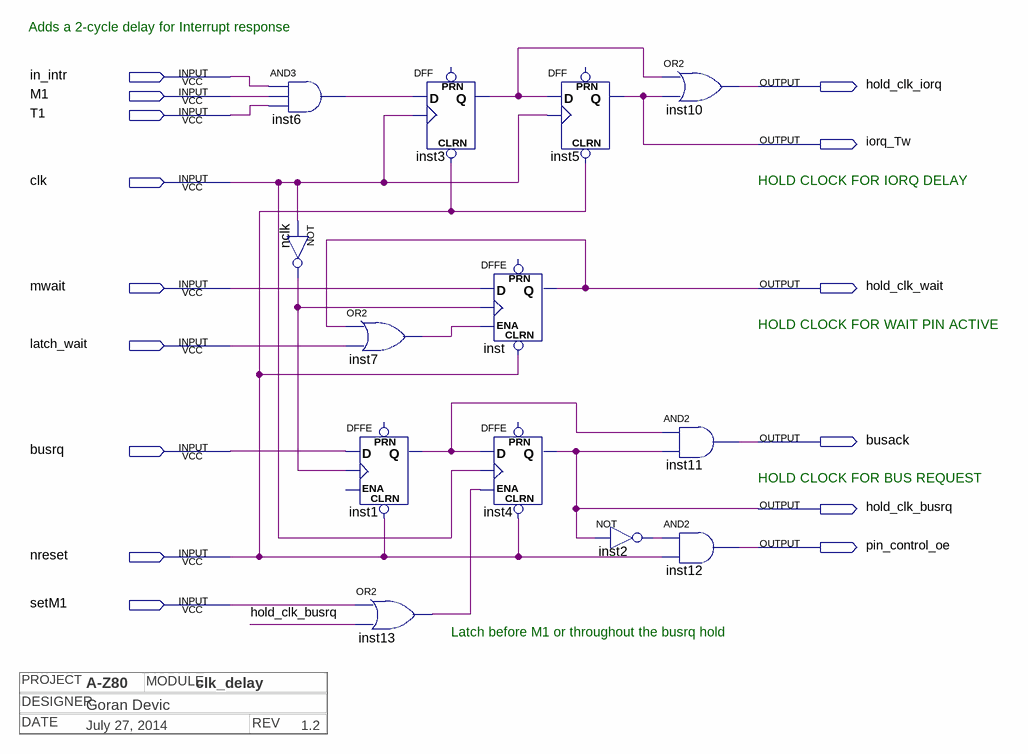
[diagram p0: schematic sheet]
// Quartus schematic clk_delay.bdf as structural Verilog: 13 symbols, 15 pins
// Title block: PROJECT: A-Z80; MODULE: clk_delay; DESIGNER: Goran Devic; DATE: July 27, 2014; REV: 1.2
module clk_delay (
  input  in_intr,
  input  M1,
  input  T1,
  input  clk,
  input  mwait,
  input  latch_wait,
  input  busrq,
  input  nreset,
  input  setM1,
  output hold_clk_iorq,
  output iorq_Tw,
  output hold_clk_wait,
  output busack,
  output hold_clk_busrq,
  output pin_control_oe
);

  wire inst1_q, inst2_out, inst3_q, inst6_out, inst7_out, inst13_out, nclk_out;

  and inst6 (inst6_out, in_intr, M1, T1);
  not nclk (nclk_out, clk);
  or inst7 (inst7_out, hold_clk_wait, latch_wait);
  DFFE inst1 (.CLRN(nreset), .D(busrq), .CLK(nclk_out), .Q(inst1_q));  // open: PRN, ENA
  DFF inst3 (.CLRN(nreset), .CLK(clk), .D(inst6_out), .Q(inst3_q));  // open: PRN
  or inst13 (inst13_out, setM1, hold_clk_busrq);
  DFFE inst (.CLRN(nreset), .D(mwait), .CLK(nclk_out), .ENA(inst7_out), .Q(hold_clk_wait));  // open: PRN
  DFFE inst4 (.CLRN(nreset), .D(inst1_q), .CLK(clk), .ENA(inst13_out), .Q(hold_clk_busrq));  // open: PRN
  DFF inst5 (.CLRN(nreset), .CLK(clk), .D(inst3_q), .Q(iorq_Tw));  // open: PRN
  not inst2 (inst2_out, hold_clk_busrq);
  or inst10 (hold_clk_iorq, inst3_q, iorq_Tw);
  and inst11 (busack, inst1_q, hold_clk_busrq);
  and inst12 (pin_control_oe, inst2_out, nreset);

  // Notes on the sheet:
  //   Adds a 2-cycle delay for Interrupt response
  //   HOLD CLOCK FOR IORQ DELAY
  //   HOLD CLOCK FOR WAIT PIN ACTIVE
  //   HOLD CLOCK FOR BUS REQUEST
  //   Latch before M1 or throughout the busrq hold
endmodule
